# Altium schematic sheet Tx_power.SchDoc: Balise IR-Tx - Power
size A3; Author: B Labbe; CompanyName: Oufffteam; DrawnBy: B Labbe; Engineer: B Labbe; Organization: Oufffteam; Address1: L3, 12a Rodborough Rd; Address2: Frenchs Forest; Address3: NSW; Address4: Australia 2086; Revision: B; SheetNumber: 2; SheetTotal: 3; DocumentName: Balise IR-Tx - Power
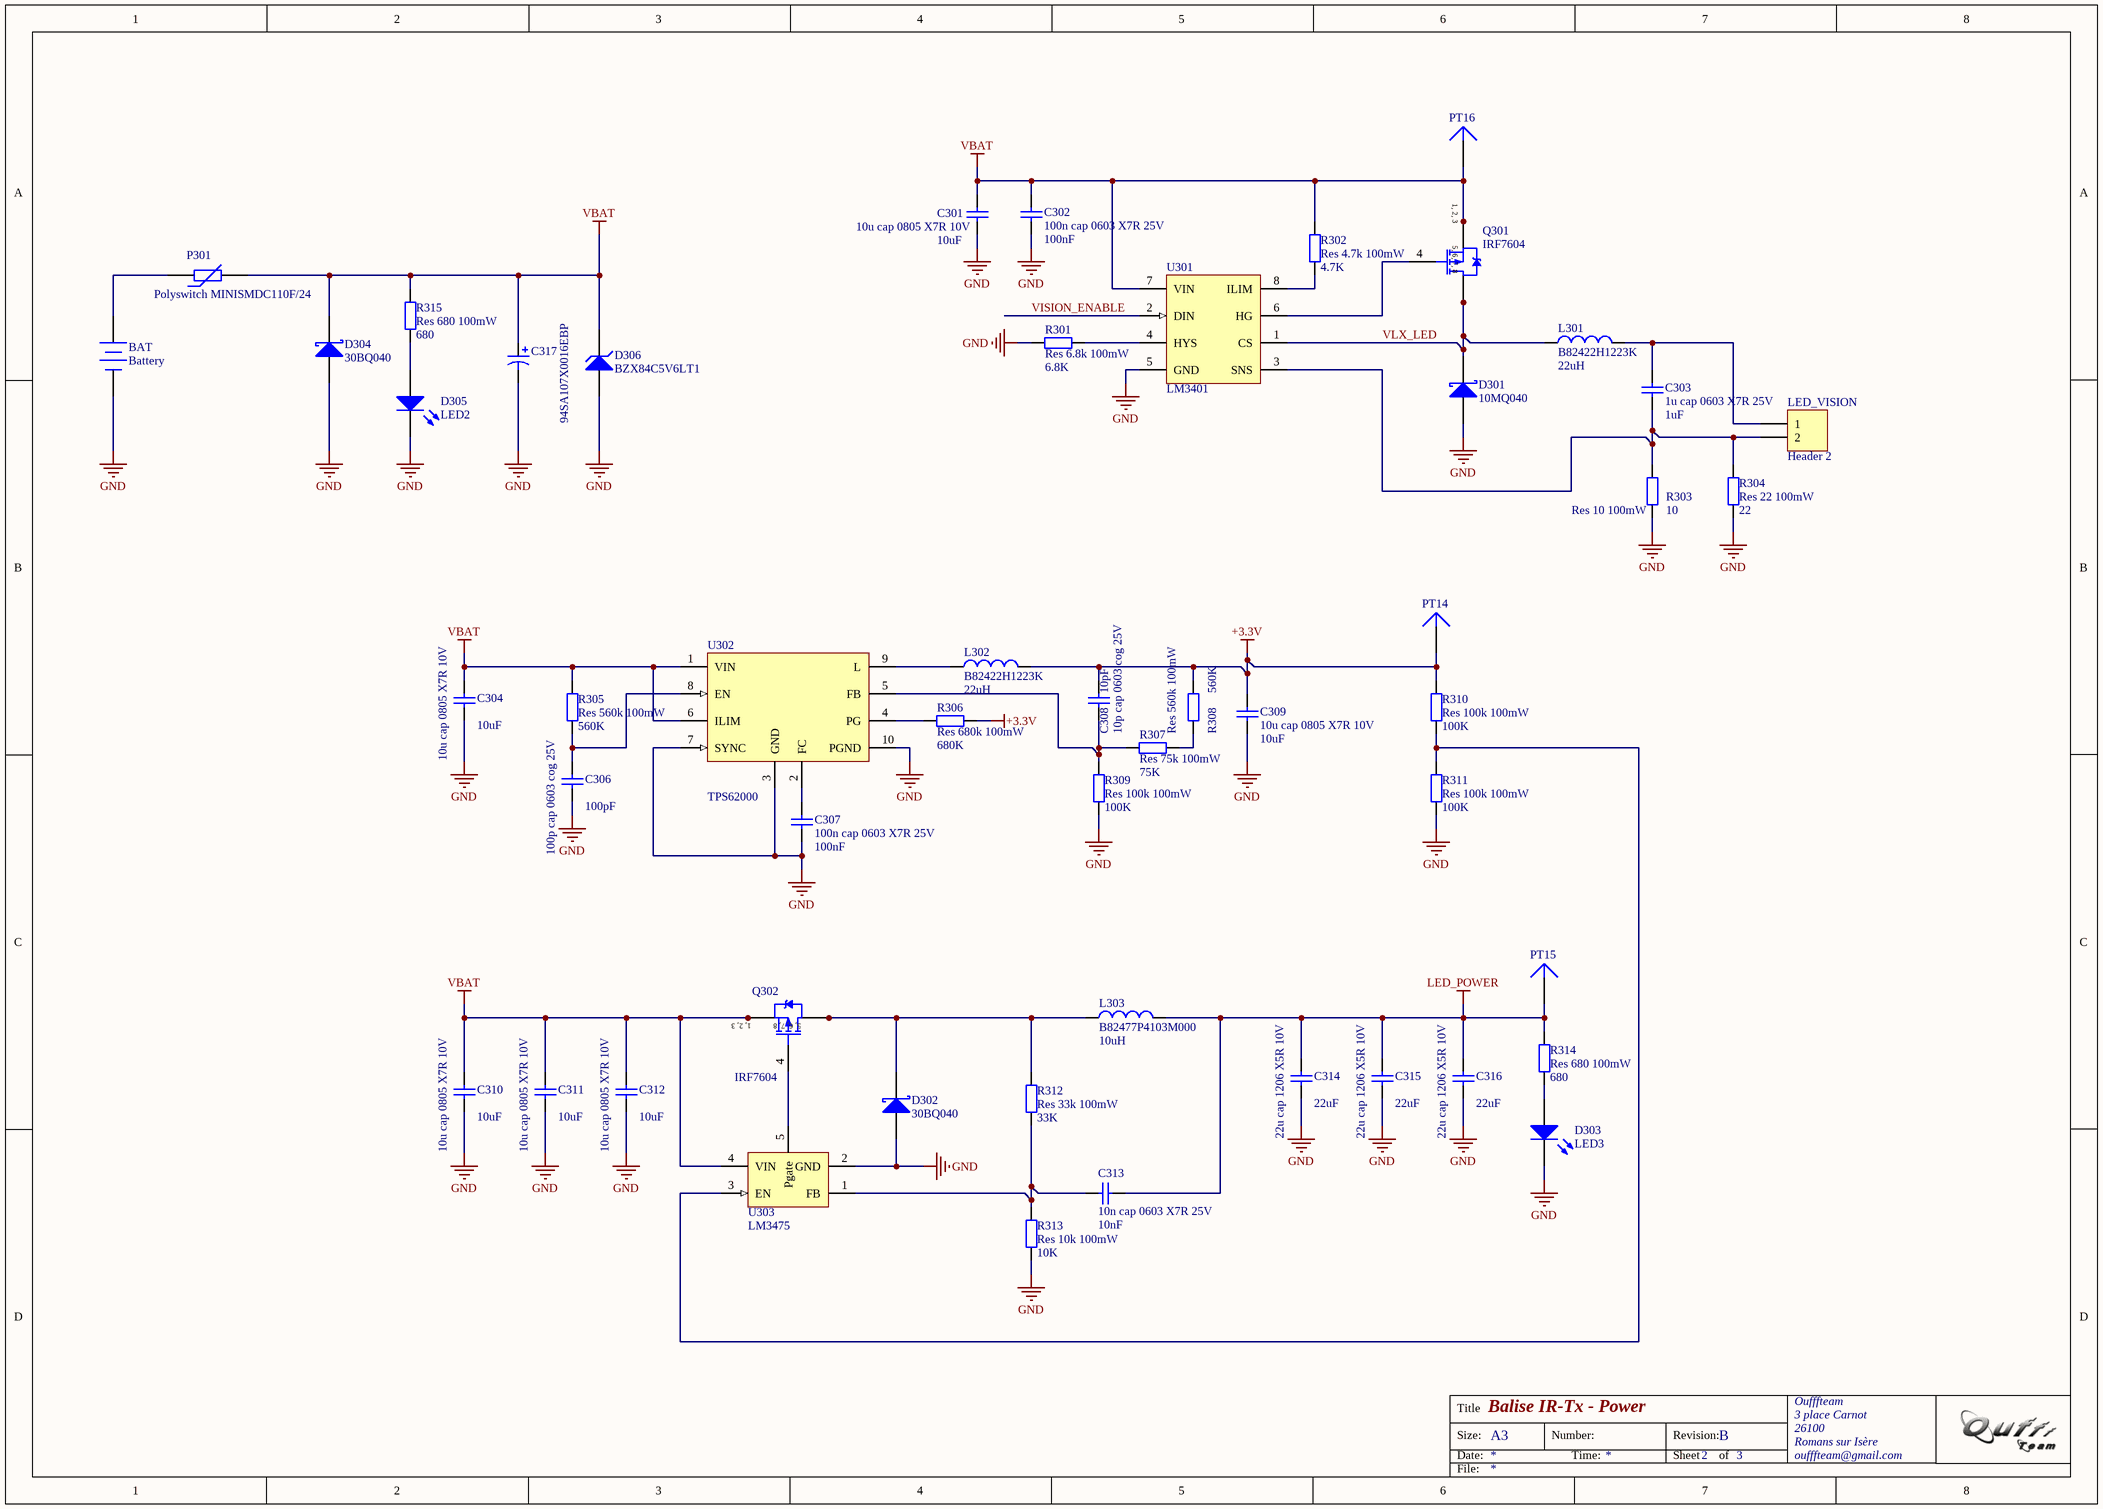
[diagram p0: Tx_power.SchDoc]

## Parts
BAT  Battery  [BAT-2]
C301  10u cap 0805 X7R 10V  value 10uF  [0805]
C302  100n cap 0603 X7R 25V  value 100nF  [0603]
C303  1u cap 0603 X7R 25V  value 1uF  [0603]
C304  10u cap 0805 X7R 10V  value 10uF  [0805]
C306  100p cap 0603 cog 25V  value 100pF  [0603]
C307  100n cap 0603 X7R 25V  value 100nF  [0603]
C308  10p cap 0603 cog 25V  value 10pF  [0603]
C309  10u cap 0805 X7R 10V  value 10uF  [0805]
C310  10u cap 0805 X7R 10V  value 10uF  [0805]
C311  10u cap 0805 X7R 10V  value 10uF  [0805]
C312  10u cap 0805 X7R 10V  value 10uF  [0805]
C313  10n cap 0603 X7R 25V  value 10nF  [0603]
C314  22u cap 1206 X5R 10V  value 22uF  [1206]
C315  22u cap 1206 X5R 10V  value 22uF  [1206]
C316  22u cap 1206 X5R 10V  value 22uF  [1206]
C317  94SA107X0016EBP  [E]
D301  10MQ040  [D-64]
D302  30BQ040  [SMC]
D303  LED3  [0603]
D304  30BQ040  [SMC]
D305  LED2  [0603]
D306  BZX84C5V6LT1  [318-07]
L301  B82422H1223K  value 22uH  [1210]
L302  B82422H1223K  value 22uH  [1210]
L303  B82477P4103M000  value 10uH  [B82477P4103M000]
LED_VISION  Header 2  [HDR1X2]
P301  Polyswitch MINISMDC110F/24  [1812]
PT14  Plug  [TP]  (value not drawn)
PT15  Plug  [TP]  (value not drawn)
PT16  Plug  [TP]  (value not drawn)
Q301  IRF7604  [Micro8]
Q302  IRF7604  [Micro8]
R301  Res 6.8k 100mW  value 6.8K  [0603]
R302  Res 4.7k 100mW  value 4.7K  [0603]
R303  Res 10 100mW  value 10  [0603]
R304  Res 22 100mW  value 22  [0603]
R305  Res 560k 100mW  value 560K  [0603]
R306  Res 680k 100mW  value 680K  [0603]
R307  Res 75k 100mW  value 75K  [0603]
R308  Res 560k 100mW  value 560K  [0603]
R309  Res 100k 100mW  value 100K  [0603]
R310  Res 100k 100mW  value 100K  [0603]
R311  Res 100k 100mW  value 100K  [0603]
R312  Res 33k 100mW  value 33K  [0603]
R313  Res 10k 100mW  value 10K  [0603]
R314  Res 680 100mW  value 680  [0603]
R315  Res 680 100mW  value 680  [0603]
U301  LM3401  [MSOP8]
U302  TPS62000  [MS10]
U303  LM3475  [SOT23-5]

## Nets
+3.3V: C308.2 C309.2 L302.2 PT14.1 R306.2 R308.2 R310.2
GND: BAT.2(-) C301.1 C302.1 C304.1 C306.1 C307.1 C309.1 C310.1 C311.1 C312.1 C314.1 C315.1 C316.1 C317.2 D301.1(A) D302.1(A) D303.2(K) D304.1(A) D305.2(K) D306.1(A) R301.1 R303.1 R304.1 R309.1 R311.1 R313.1 U301.5(GND) U302.3(GND) U302.7(SYNC) U302.10(PGND) U303.2(GND)
LED_POWER: C313.2 C314.2 C315.2 C316.2 L303.2 PT15.1 R314.2
VBAT: C301.2 C302.2 C304.2 C310.2 C311.2 C312.2 C317.1 D304.2(K) D306.3(K) P301.2 PT16.1 Q301.1(S) Q301.2(S) Q301.3(S) Q302.1(S) Q302.2(S) Q302.3(S) R302.2 R305.2 R315.2 U301.7(VIN) U302.1(VIN) U302.6(ILIM) U303.4(VIN)
VISION_ENABLE: U301.2(DIN)
VLX_LED: D301.2(K) L301.1 Q301.5(D) Q301.6(D) Q301.7(D) Q301.8(D) U301.1(CS)
NetBAT_1: BAT.1(+) P301.1
NetC303_1: C303.1 LED_VISION.2 R303.2 R304.2 U301.3(SNS)
NetC303_2: C303.2 L301.2 LED_VISION.1
NetC306_2: C306.2 R305.1 U302.8(EN)
NetC307_2: C307.2 U302.2(FC)
NetC308_1: C308.1 R307.1 R309.2 U302.5(FB)
NetC313_1: C313.1 R312.1 R313.2 U303.1(FB)
NetD302_2: D302.2(K) L303.1 Q302.5(D) Q302.6(D) Q302.7(D) Q302.8(D) R312.2
NetD303_1: D303.1(A) R314.1
NetD305_1: D305.1(A) R315.1
NetL302_1: L302.1 U302.9(L)
NetQ301_4: Q301.4(G) U301.6(HG)
NetQ302_4: Q302.4(G) U303.5(Pgate)
NetR301_2: R301.2 U301.4(HYS)
NetR302_1: R302.1 U301.8(ILIM)
NetR306_1: R306.1 U302.4(PG)
NetR307_2: R307.2 R308.1
NetR310_1: R310.1 R311.2 U303.3(EN)

## Notes on the sheet
- Title
- Size:
- Date:
- A3
- Number:
- Time:
- Revision:
- Sheet
- of
- Oufffteam
- 3 place Carnot
- 26100
- Romans sur Isère
- oufffteam@gmail.com
- File:
- (in symbol IRF7604) 1, 2, 3; 5, 6, 7, 8

## Library data of the parts
BAT = Battery: Multicell Battery; Published: 24-Mar-1999; LatestRevisionDate: 17-Jul-2002; LatestRevisionNote: Re-released for DXP Platform.; PackageReference: BAT-2; Publisher: Altium Limited
C301-C304 C306-C316 = Cap: Capacitor; Published: 8-Jun-2000; LatestRevisionDate: 17-Jul-2002; LatestRevisionNote: Re-released for DXP Platform.; PackageReference: RAD-0.3; Publisher: Altium Limited
C317 = 94SA107X0016EBP: Solid Aluminum Capacitor with Organic Semiconductor Electrolyte: 100uF, 16V, Bulk Pack; Note: Part Numbers shown are for ± 20% capacitance tolerance (X0).; PCB_Layout: Complies with Manufacturer's Recommendation.; DrillSize: Nominal, Rounded to the nearest 0.1mm; Published: 19-Mar-2004; DatasheetDocument: 29-Jun-2001; PackageReference: E; Publisher: Altium Limited; ComponentLink1Description: Manufacturer Link; ComponentLink1URL: http://www.vishay.com/; ComponentLink2Description: Datasheet; ComponentLink2URL: http://www.vishay.com/docs/90003/94sa.pdf; Value: 100uF
D301 = 10MQ040: Schottky Rectifier; Published: 8-Jun-2000; LatestRevisionDate: 17-Jul-2002; LatestRevisionNote: Re-released for DXP Platform.; DatasheetDocument: Dec-1997; PackageReference: D-64; Publisher: Altium Limited; ComponentLink1Description: Manufacturer Link; ComponentLink1URL: http://www.irf.com/; ComponentLink2Description: Datasheet; ComponentLink2URL: http://www.irf.com/product-info/datasheets/data/10mq040n.pdf
D302 D304 = 30BQ040: Schottky Rectifier; Published: 8-Jun-2000; LatestRevisionDate: 17-Jul-2002; LatestRevisionNote: Re-released for DXP Platform.; DatasheetDocument: PD-2.439; PackageReference: SMC; Publisher: Altium Limited; Code_JEDEC: DO-214-AB; ComponentLink1Description: Manufacturer Link; ComponentLink1URL: http://www.irf.com/; ComponentLink2Description: Datasheet; ComponentLink2URL: http://www.irf.com/product-info/datasheets/data/30bq040.pdf
D303 = LED3: Typical BLUE SiC LED; Published: 8-Jun-2000; LatestRevisionDate: 17-Dec-2003; LatestRevisionNote: PCB Footprint replaced.; DatasheetDocument: 16-Apr-2002; PackageDocument: 16-Apr-2002; PackageReference: 3.5X2.8X1.9; Publisher: Altium Limited
D305 = LED2: Typical RED, GREEN, YELLOW, AMBER GaAs LED; Published: 8-Jun-2000; LatestRevisionDate: 17-Jul-2002; LatestRevisionNote: Re-released for DXP Platform.; PackageDocument: Feb-2002; PackageReference: 3.2X1.6X1.1; Publisher: Altium Limited
D306 = BZX84C5V6LT1: Zener Voltage Regulator Diode; Note: Pin 2 is not connected and not drawn.; Published: 29-Sep-2000; LatestRevisionDate: 17-Jul-2002; LatestRevisionNote: Re-released for DXP Platform.; PackageReference: 318-07; Publisher: Altium Limited; PackageDescription: SOT-23; 3 Leads; Body 3.0 x 2.5 mm, inc. leads (LxW max); ComponentLink1Description: Manufacturer Link; ComponentLink1URL: http://www.onsemi.com/site/products/landing?taxonomyID=194; ComponentLink2Description: Datasheet; ComponentLink2URL: http://www.onsemi.com/pub/Collateral/BZX84C2V4LT1-D.PDF
L301-L303 = Inductor: Code_IEC: 1005; Published: 8-Jun-2000; LatestRevisionDate: 17-Jul-2002; LatestRevisionNote: Re-released for DXP Platform.; PackageReference: 0402-A; Publisher: Altium Limited; Code_JEITA: 0402
LED_VISION = Header 2: Header, 2-Pin; LatestRevisionDate: 17-Jul-2002; LatestRevisionNote: Re-released for DXP Platform.; Publisher: Altium Limited
P301 = Res Varistor: Varistor (Voltage-Sensitive Resistor); Published: 24-Mar-1999; LatestRevisionDate: 04-Mar-2005; LatestRevisionNote: PCB Footprint replaced.; PackageReference: 6-0805; Publisher: Altium Limited
Q301 Q302 = IRF7604: HEXFET Power MOSFET; Published: 8-Jun-2000; LatestRevisionDate: 04-Mar-2005; LatestRevisionNote: Stylized 3D Model Added.; DatasheetVersion: Dec-1997; PackageReference: Micro8; Publisher: Altium Limited; PackageDescription: Shrink Small Outline; 8 Leads; Body Width 3 mm; Pitch 0.65 mm; ComponentLink1Description: Manufacturer Link; ComponentLink1URL: http://www.irf.com/; ComponentLink2Description: Datasheet; ComponentLink2URL: http://www.irf.com/product-info/datasheets/data/irf7604.pdf
R301-R315 = Res2: Resistor; Published: 8-Jun-2000; LatestRevisionDate: 17-Jul-2002; LatestRevisionNote: Re-released for DXP Platform.; PackageReference: AXIAL-0.4; Publisher: Altium Limited
U301 = LM3401: Hysteretic PFET Controller for High Power LED Drive
U302 = TPS6200x: HIGH-EFFICIENCY STEP-DOWN LOW POWER DC-DC CONVERTER
U303 = LM3475: Hysteretic PFET Buck Controller
PT14-PT16 = Plug: LatestRevisionDate: 17-Jul-2002; LatestRevisionNote: Re-released for DXP Platform.; Publisher: Altium Limited